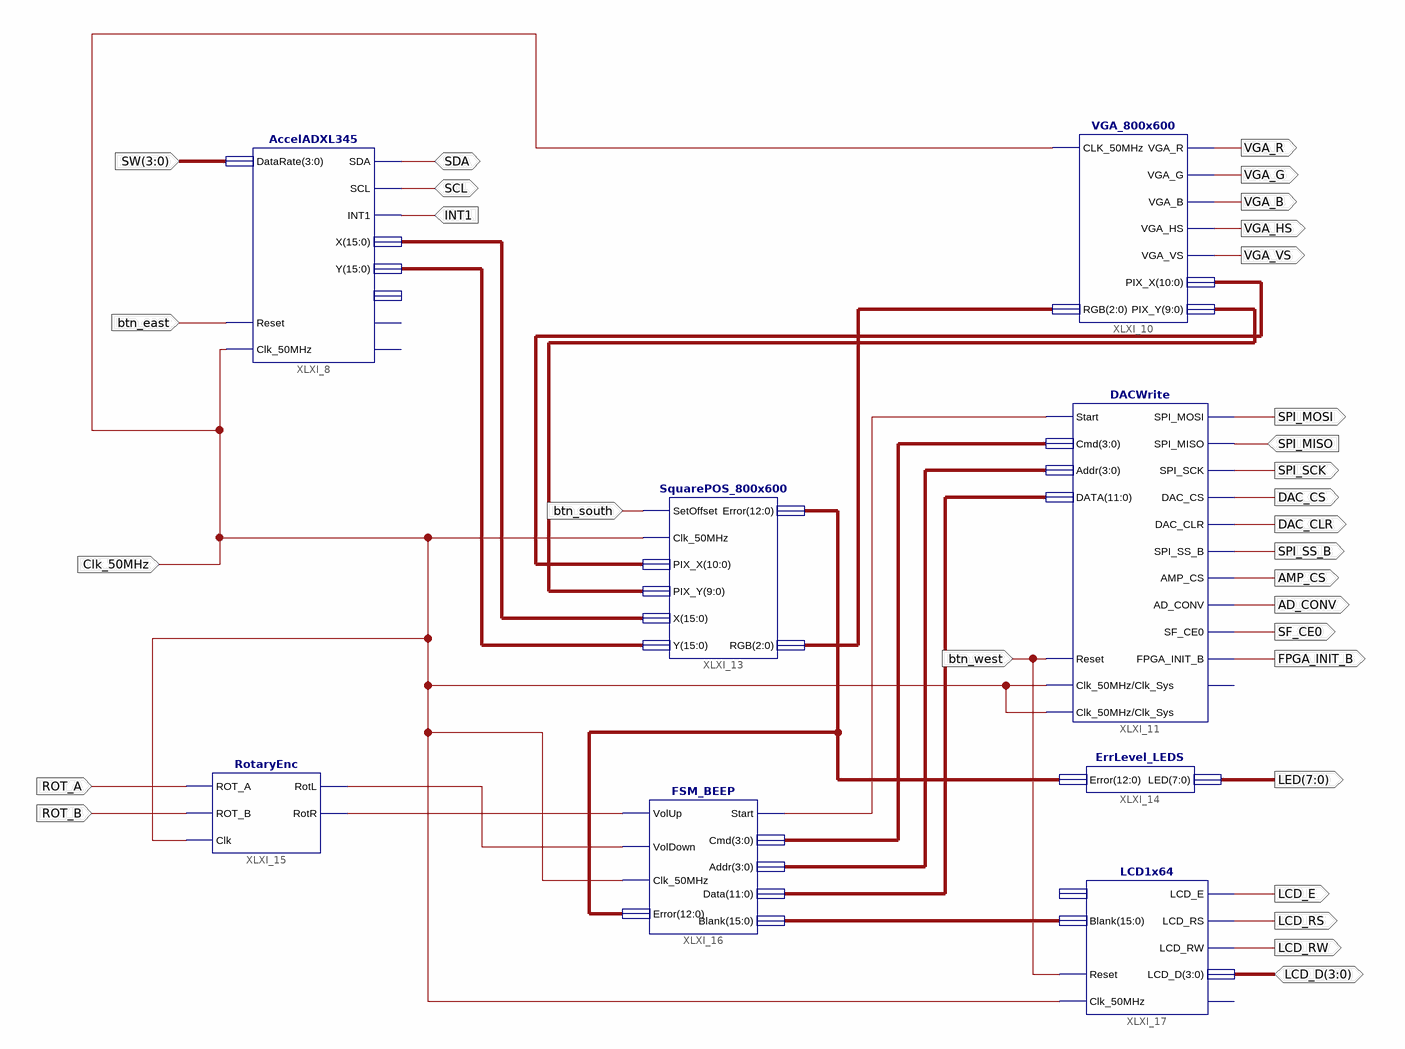
[diagram p0: schematic sheet 1]
// Xilinx ISE schematic Accelerometer.sch (spartan3e) as structural Verilog: 8 symbols, 30 ports
module Accelerometer (
  input  [3:0] SW,
  input  btn_east,
  input  Clk_50MHz,
  input  INT1,
  input  btn_south,
  input  btn_west,
  input  SPI_MISO,
  input  ROT_A,
  input  ROT_B,
  inout  SDA,
  inout  SCL,
  inout  [3:0] LCD_D,
  output VGA_R,
  output VGA_G,
  output VGA_B,
  output VGA_HS,
  output VGA_VS,
  output SPI_MOSI,
  output SPI_SCK,
  output DAC_CS,
  output DAC_CLR,
  output SPI_SS_B,
  output AMP_CS,
  output AD_CONV,
  output SF_CE0,
  output FPGA_INIT_B,
  output [7:0] LED,
  output LCD_E,
  output LCD_RS,
  output LCD_RW
);

  wire XLXN_67, XLXN_85, XLXN_91;
  wire [2:0] XLXN_76;
  wire [3:0] XLXN_68, XLXN_69;
  wire [9:0] XLXN_65;
  wire [10:0] XLXN_64;
  wire [11:0] XLXN_70;
  wire [12:0] XLXN_80;
  wire [15:0] XLXN_55, XLXN_56, XLXN_94;

  AccelADXL345 XLXI_8 (
    .SDA(SDA), .SCL(SCL), .INT1(INT1), .X(XLXN_55), .Y(XLXN_56), .Clk_50MHz(Clk_50MHz), .Reset(btn_east),
    .DataRate(SW));  // open: Z, NewData, I2C_NACK
  VGA_800x600 XLXI_10 (
    .CLK_50MHz(Clk_50MHz), .RGB(XLXN_76), .VGA_R(VGA_R), .VGA_G(VGA_G), .VGA_B(VGA_B), .VGA_HS(VGA_HS),
    .VGA_VS(VGA_VS), .PIX_X(XLXN_64), .PIX_Y(XLXN_65));
  DACWrite XLXI_11 (
    .Reset(btn_west), .Start(XLXN_67), .SPI_MISO(SPI_MISO), .Cmd(XLXN_68), .Addr(XLXN_69), .DATA(XLXN_70),
    .DAC_CLR(DAC_CLR), .DAC_CS(DAC_CS), .SPI_MOSI(SPI_MOSI), .SPI_SCK(SPI_SCK), .SPI_SS_B(SPI_SS_B),
    .AMP_CS(AMP_CS), .AD_CONV(AD_CONV), .SF_CE0(SF_CE0), .FPGA_INIT_B(FPGA_INIT_B), .Clk_50MHz(Clk_50MHz),
    .Clk_Sys(Clk_50MHz));  // open: Busy
  SquarePOS_800x600 XLXI_13 (
    .SetOffset(btn_south), .Clk_50MHz(Clk_50MHz), .PIX_X(XLXN_64), .PIX_Y(XLXN_65), .X(XLXN_55), .Y(XLXN_56),
    .Error(XLXN_80), .RGB(XLXN_76));
  ErrLevel_LEDS XLXI_14 (.Error(XLXN_80), .LED(LED));
  RotaryEnc XLXI_15 (.ROT_A(ROT_A), .ROT_B(ROT_B), .RotL(XLXN_91), .RotR(XLXN_85), .Clk(Clk_50MHz));
  FSM_BEEP XLXI_16 (
    .VolUp(XLXN_85), .VolDown(XLXN_91), .Clk_50MHz(Clk_50MHz), .Error(XLXN_80), .Start(XLXN_67),
    .Cmd(XLXN_68), .Addr(XLXN_69), .Data(XLXN_70), .Blank(XLXN_94));
  LCD1x64 XLXI_17 (
    .Clk_50MHz(Clk_50MHz), .Reset(btn_west), .Blank(XLXN_94), .LCD_D(LCD_D), .LCD_E(LCD_E), .LCD_RW(LCD_RW),
    .LCD_RS(LCD_RS));  // open: Line, SF_CE
endmodule
